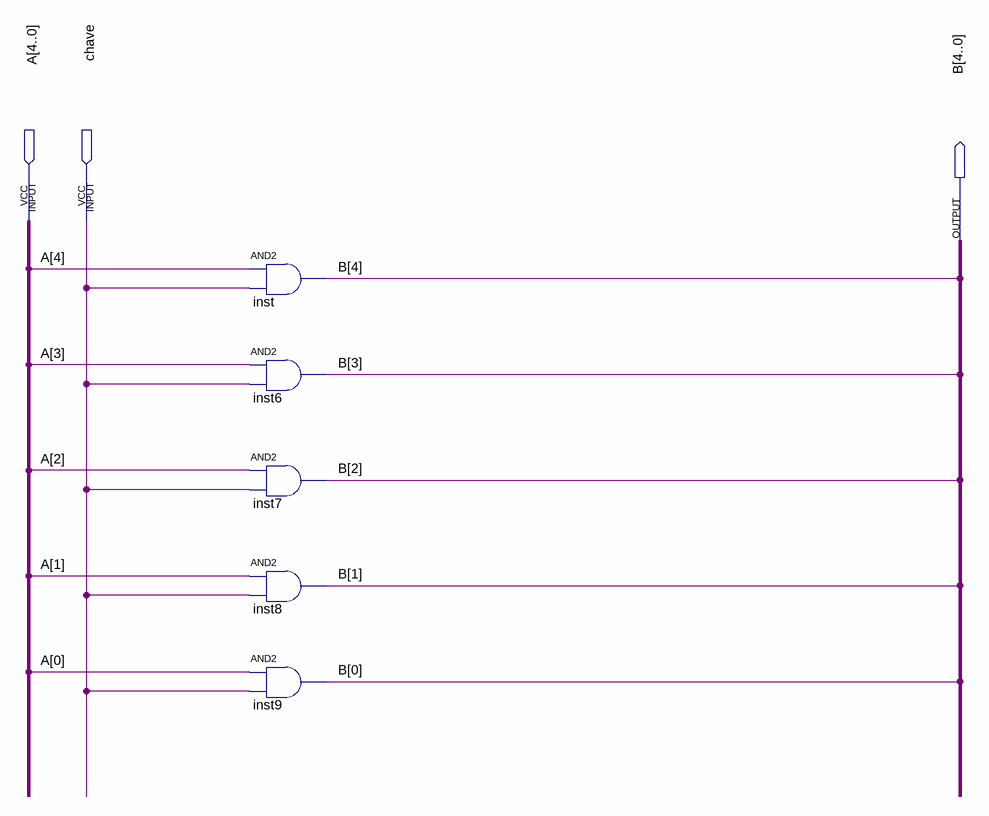
[diagram p0: schematic sheet]
// Quartus schematic NegadorDeA.bdf as structural Verilog: 5 symbols, 3 pins
module NegadorDeA (
  input  [4:0] A,
  input  chave,
  output [4:0] B
);

  and inst (B[4], A[4], chave);
  and inst6 (B[3], A[3], chave);
  and inst7 (B[2], A[2], chave);
  and inst8 (B[1], A[1], chave);
  and inst9 (B[0], A[0], chave);
endmodule
